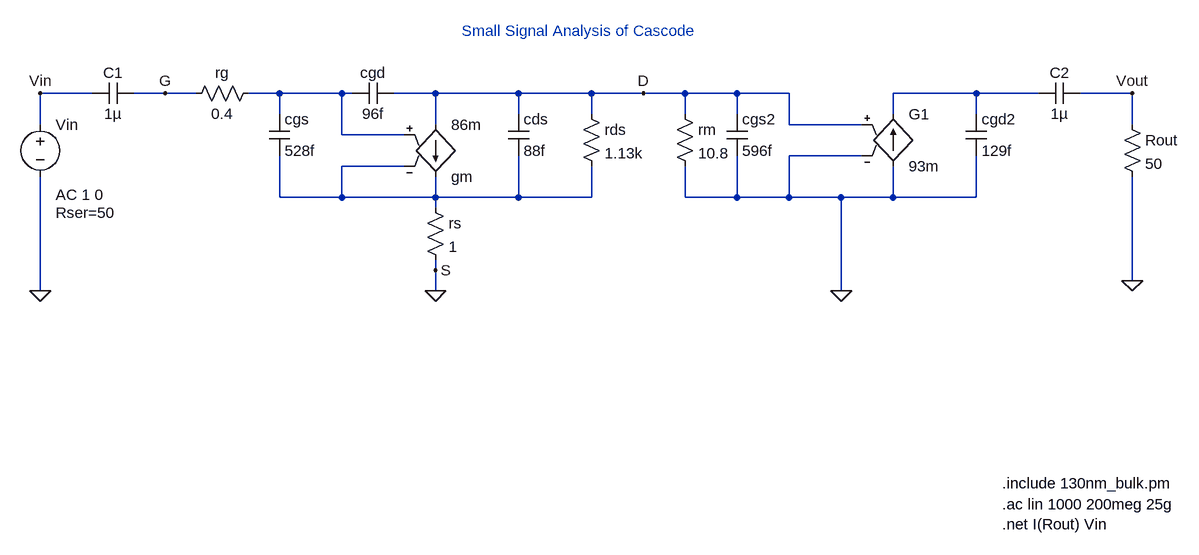
[diagram p0: schematic Small_Signal_Analysis_Cascode.asc]
Small_Signal_Analysis_Cascode.asc, the LTspice schematic file:
Version 4
SHEET 1 1408 1076
WIRE -272 64 -352 64
WIRE -160 64 -208 64
WIRE -112 64 -160 64
WIRE 16 64 -32 64
WIRE 112 64 16 64
WIRE 128 64 112 64
WIRE 256 64 192 64
WIRE 384 64 256 64
WIRE 496 64 384 64
WIRE 576 64 496 64
WIRE 640 64 576 64
WIRE 720 64 640 64
WIRE 800 64 720 64
WIRE 1088 64 960 64
WIRE 1184 64 1088 64
WIRE 1328 64 1248 64
WIRE 16 96 16 64
WIRE 384 96 384 64
WIRE 496 96 496 64
WIRE 640 96 640 64
WIRE 720 96 720 64
WIRE 960 96 960 64
WIRE 1088 96 1088 64
WIRE -352 112 -352 64
WIRE 256 112 256 64
WIRE 800 112 800 64
WIRE 912 112 800 112
WIRE 1328 112 1328 64
WIRE 112 128 112 64
WIRE 208 128 112 128
WIRE 912 160 800 160
WIRE 208 176 112 176
WIRE 16 224 16 160
WIRE 112 224 112 176
WIRE 112 224 16 224
WIRE 256 224 256 192
WIRE 256 224 112 224
WIRE 384 224 384 160
WIRE 384 224 256 224
WIRE 496 224 496 176
WIRE 496 224 384 224
WIRE 640 224 640 176
WIRE 720 224 720 160
WIRE 720 224 640 224
WIRE 800 224 800 160
WIRE 800 224 720 224
WIRE 880 224 800 224
WIRE 960 224 960 176
WIRE 960 224 880 224
WIRE 1088 224 1088 160
WIRE 1088 224 960 224
WIRE 256 240 256 224
WIRE 256 336 256 320
WIRE 1328 352 1328 192
WIRE -352 368 -352 192
WIRE 256 368 256 336
WIRE 880 368 880 224
FLAG 256 368 0
FLAG 1328 352 0
FLAG -352 368 0
FLAG -352 64 Vin
FLAG 1328 64 Vout
FLAG 880 368 0
FLAG -160 64 G
FLAG 256 336 S
FLAG 576 64 D
SYMBOL res 240 224 R0
SYMATTR InstName rs
SYMATTR Value 1
SYMBOL cap 0 96 R0
SYMATTR InstName cgs
SYMATTR Value 528f
SYMBOL cap 368 96 R0
SYMATTR InstName cds
SYMATTR Value 88f
SYMBOL res 480 80 R0
SYMATTR InstName rds
SYMATTR Value 1.13k
SYMBOL cap 192 48 R90
WINDOW 0 0 32 VBottom 2
WINDOW 3 32 32 VTop 2
SYMATTR InstName cgd
SYMATTR Value 96f
SYMBOL cap 1248 48 R90
WINDOW 0 0 32 VBottom 2
WINDOW 3 32 32 VTop 2
SYMATTR InstName C2
SYMATTR Value 1µ
SYMBOL res 1312 96 R0
SYMATTR InstName Rout
SYMATTR Value 50
SYMBOL res -16 48 R90
WINDOW 0 0 56 VBottom 2
WINDOW 3 32 56 VTop 2
SYMATTR InstName rg
SYMATTR Value 0.4
SYMBOL cap -208 48 R90
WINDOW 0 0 32 VBottom 2
WINDOW 3 32 32 VTop 2
SYMATTR InstName C1
SYMATTR Value 1µ
SYMBOL voltage -352 96 R0
WINDOW 123 24 124 Left 2
WINDOW 39 24 152 Left 2
SYMATTR Value2 AC 1 0
SYMATTR SpiceLine Rser=50
SYMATTR InstName Vin
SYMATTR Value ""
SYMBOL g 960 80 R0
SYMATTR InstName G1
SYMATTR Value 93m
SYMBOL cap 704 96 R0
SYMATTR InstName cgs2
SYMATTR Value 596f
SYMBOL cap 1072 96 R0
SYMATTR InstName cgd2
SYMATTR Value 129f
SYMBOL res 624 80 R0
SYMATTR InstName rm
SYMATTR Value 10.8
SYMBOL g2 256 208 M180
SYMATTR InstName gm
SYMATTR Value 86m
TEXT 1128 696 Left 2 !.ac lin 1000 200meg 25g\n.net I(Rout) Vin
TEXT 1128 664 Left 2 !.include 130nm_bulk.pm
TEXT 296 -32 Left 2 ;Small Signal Analysis of Cascode

The netlist it stands for:
* Small_Signal_Analysis_Cascode.asc
rs N003 0 1
cgs N001 N003 528f
cds D N003 88f
rds D N003 1.13k
cgd D N001 96f
C2 Vout N002 1µ
Rout Vout 0 50
rg N001 G 0.4
C1 G Vin 1µ
Vin Vin 0 AC 1 0 Rser=50
G1 0 N002 D 0 93m
cgs2 D 0 596f
cgd2 N002 0 129f
rm D 0 10.8
gm D N003 N001 N003 86m
.ac lin 1000 200meg 25g
.net I(Rout) Vin
.include 130nm_bulk.pm
* Small Signal Analysis of Cascode
.backanno
.end